# Altium schematic sheet panel-8-touch-pad.SchDoc
size B
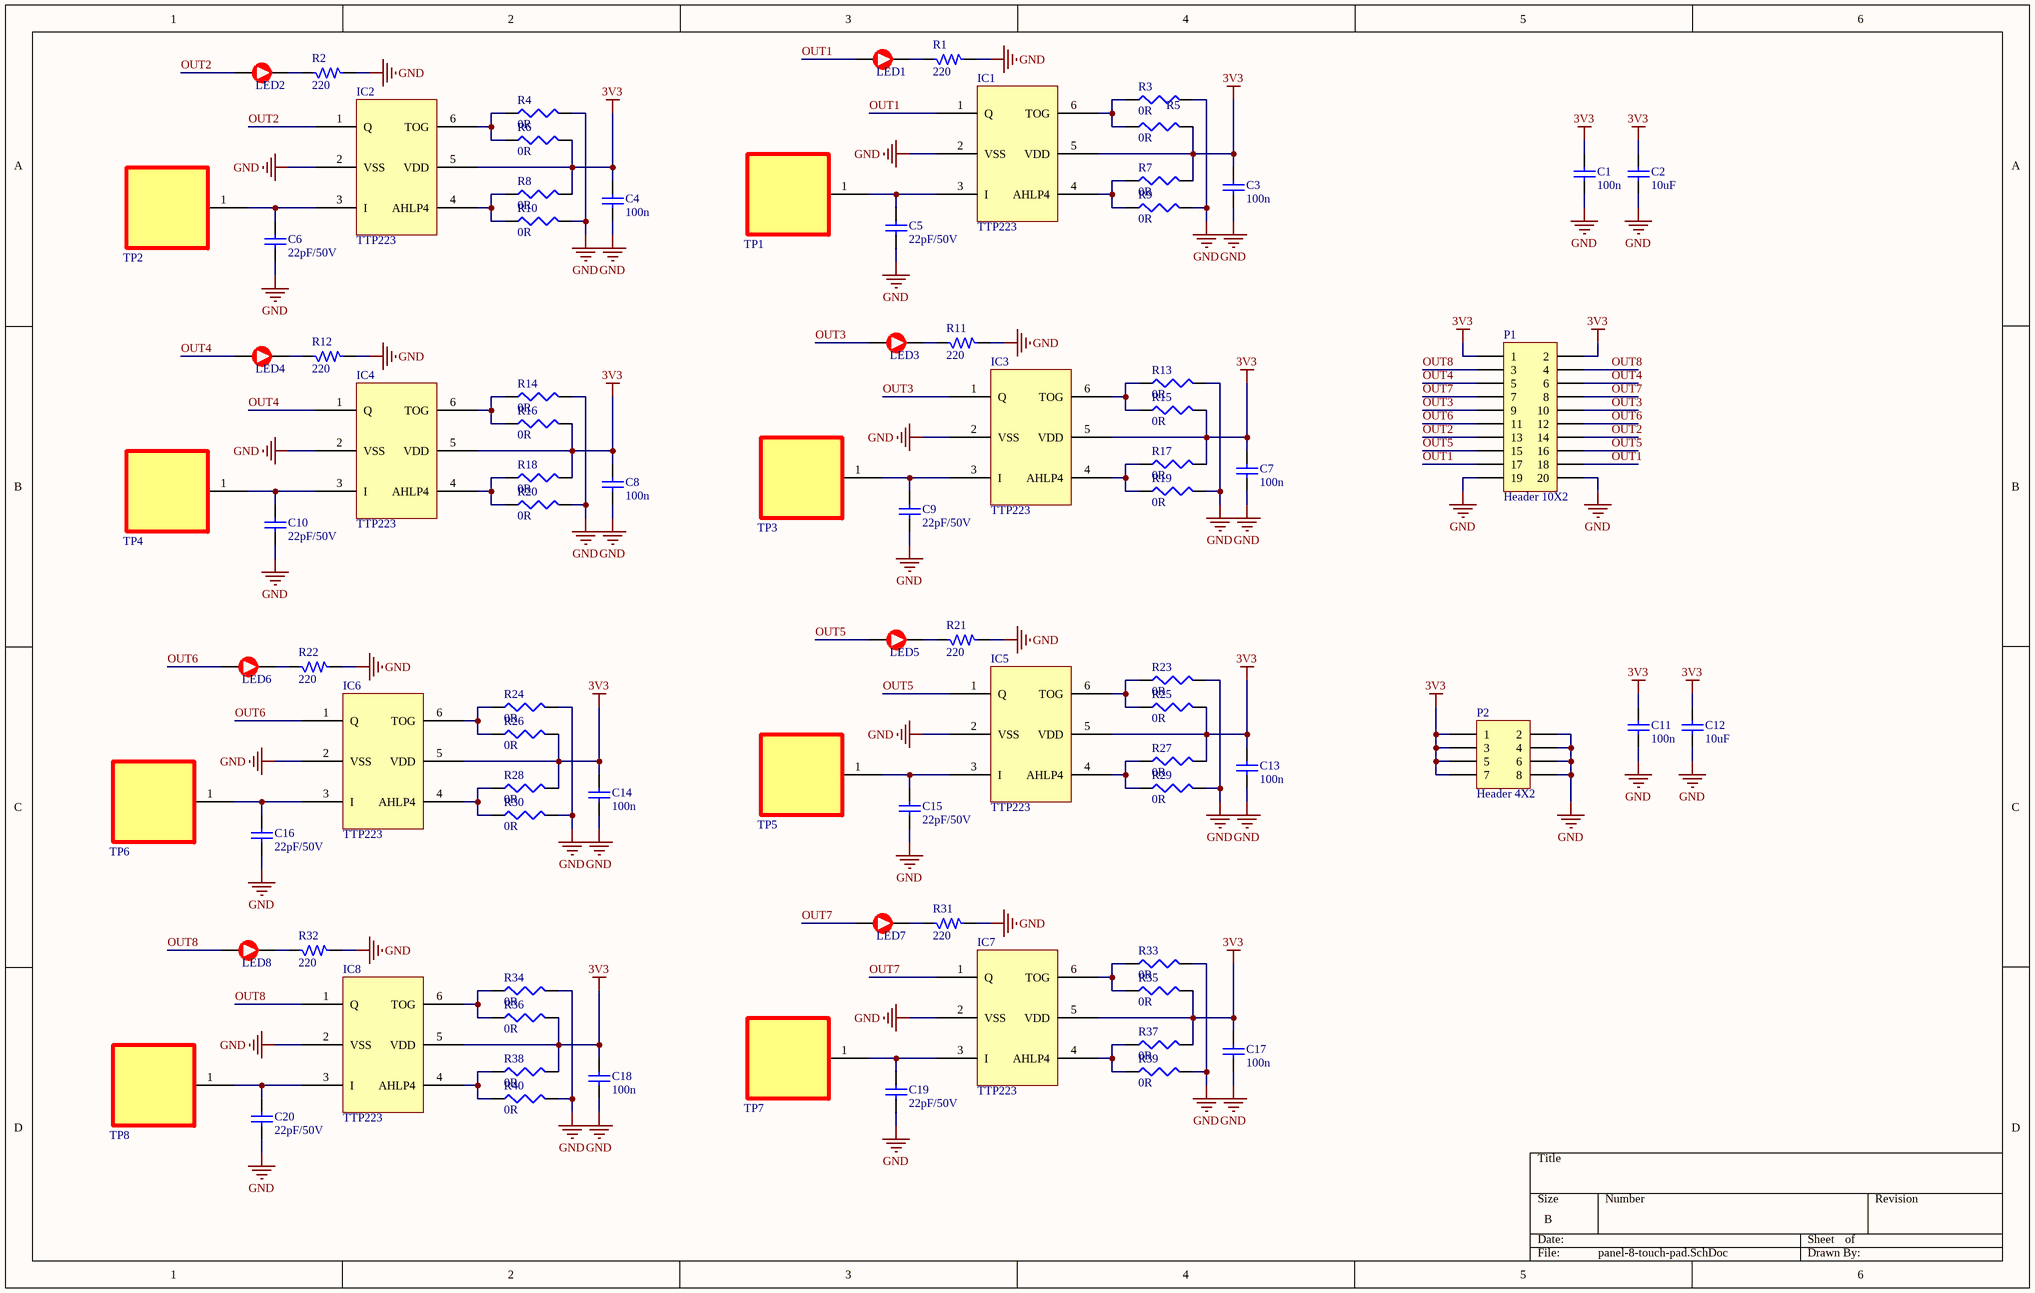
[diagram p0: panel-8-touch-pad.SchDoc]

## Parts
C1  100n  [C0805]
C2  10uF  [C1206]
C3  100n  [C0805]
C4  100n  [C0805]
C5  22pF/50V  [C0805]
C6  22pF/50V  [C0805]
C7  100n  [C0805]
C8  100n  [C0805]
C9  22pF/50V  [C0805]
C10  22pF/50V  [C0805]
C11  100n  [C0805]
C12  10uF  [C1206]
C13  100n  [C0805]
C14  100n  [C0805]
C15  22pF/50V  [C0805]
C16  22pF/50V  [C0805]
C17  100n  [C0805]
C18  100n  [C0805]
C19  22pF/50V  [C0805]
C20  22pF/50V  [C0805]
IC1  TTP223  [SOT23-6_L]
IC2  TTP223  [SOT23-6_L]
IC3  TTP223  [SOT23-6_L]
IC4  TTP223  [SOT23-6_L]
IC5  TTP223  [SOT23-6_L]
IC6  TTP223  [SOT23-6_L]
IC7  TTP223  [SOT23-6_L]
IC8  TTP223  [SOT23-6_L]
LED1  (no value)  [LED_0805_Blue]
LED2  (no value)  [LED_0805_Blue]
LED3  (no value)  [LED_0805_Blue]
LED4  (no value)  [LED_0805_Blue]
LED5  (no value)  [LED_0805_Blue]
LED6  (no value)  [LED_0805_Blue]
LED7  (no value)  [LED_0805_Blue]
LED8  (no value)  [LED_0805_Blue]
P1  Header 10X2  [HDR2X10 - SMD - 2mm]
P2  Header 4X2  [HDR2X4 - SMD - 2mm]
R1  220  [R0805]
R2  220  [R0805]
R3  0R  [R0805]
R4  0R  [R0805]
R5  0R  [R0805]
R6  0R  [R0805]
R7  0R  [R0805]
R8  0R  [R0805]
R9  0R  [R0805]
R10  0R  [R0805]
R11  220  [R0805]
R12  220  [R0805]
R13  0R  [R0805]
R14  0R  [R0805]
R15  0R  [R0805]
R16  0R  [R0805]
R17  0R  [R0805]
R18  0R  [R0805]
R19  0R  [R0805]
R20  0R  [R0805]
R21  220  [R0805]
R22  220  [R0805]
R23  0R  [R0805]
R24  0R  [R0805]
R25  0R  [R0805]
R26  0R  [R0805]
R27  0R  [R0805]
R28  0R  [R0805]
R29  0R  [R0805]
R30  0R  [R0805]
R31  220  [R0805]
R32  220  [R0805]
R33  0R  [R0805]
R34  0R  [R0805]
R35  0R  [R0805]
R36  0R  [R0805]
R37  0R  [R0805]
R38  0R  [R0805]
R39  0R  [R0805]
R40  0R  [R0805]
TP1  TP  [Touch-Pad-Rec]  (value not drawn)
TP2  TP  [Touch-Pad-Rec]  (value not drawn)
TP3  TP  [Touch-Pad-Rec]  (value not drawn)
TP4  TP  [Touch-Pad-Rec]  (value not drawn)
TP5  TP  [Touch-Pad-Rec]  (value not drawn)
TP6  TP  [Touch-Pad-Rec]  (value not drawn)
TP7  TP  [Touch-Pad-Rec]  (value not drawn)
TP8  TP  [Touch-Pad-Rec]  (value not drawn)

## Nets
3V3: C1.1 C2.1 C3.1 C4.1 C7.1 C8.1 C11.1 C12.1 C13.1 C14.1 C17.1 C18.1 IC1.5(VDD) IC2.5(VDD) IC3.5(VDD) IC4.5(VDD) IC5.5(VDD) IC6.5(VDD) IC7.5(VDD) IC8.5(VDD) P1.1 P1.2 P2.1 P2.3 P2.5 P2.7 R5.2 R6.2 R7.2 R8.2 R15.2 R16.2 R17.2 R18.2 R25.2 R26.2 R27.2 R28.2 R35.2 R36.2 R37.2 R38.2
GND: C1.2 C2.2 C3.2 C4.2 C5.2 C6.2 C7.2 C8.2 C9.2 C10.2 C11.2 C12.2 C13.2 C14.2 C15.2 C16.2 C17.2 C18.2 C19.2 C20.2 IC1.2(VSS) IC2.2(VSS) IC3.2(VSS) IC4.2(VSS) IC5.2(VSS) IC6.2(VSS) IC7.2(VSS) IC8.2(VSS) P1.19 P1.20 P2.2 P2.4 P2.6 P2.8 R1.2 R2.2 R3.2 R4.2 R9.2 R10.2 R11.2 R12.2 R13.2 R14.2 R19.2 R20.2 R21.2 R22.2 R23.2 R24.2 R29.2 R30.2 R31.2 R32.2 R33.2 R34.2 R39.2 R40.2
OUT1: IC1.1(Q) LED1.2 P1.17 P1.18
OUT2: IC2.1(Q) LED2.2 P1.13 P1.14
OUT3: IC3.1(Q) LED3.2 P1.9 P1.10
OUT4: IC4.1(Q) LED4.2 P1.5 P1.6
OUT5: IC5.1(Q) LED5.2 P1.15 P1.16
OUT6: IC6.1(Q) LED6.2 P1.11 P1.12
OUT7: IC7.1(Q) LED7.2 P1.7 P1.8
OUT8: IC8.1(Q) LED8.2 P1.3 P1.4
NetC5_1: C5.1 IC1.3(I) TP1.1
NetC6_1: C6.1 IC2.3(I) TP2.1
NetC9_1: C9.1 IC3.3(I) TP3.1
NetC10_1: C10.1 IC4.3(I) TP4.1
NetC15_1: C15.1 IC5.3(I) TP5.1
NetC16_1: C16.1 IC6.3(I) TP6.1
NetC19_1: C19.1 IC7.3(I) TP7.1
NetC20_1: C20.1 IC8.3(I) TP8.1
NetIC1_4: IC1.4(AHLP4) R7.1 R9.1
NetIC1_6: IC1.6(TOG) R3.1 R5.1
NetIC2_4: IC2.4(AHLP4) R8.1 R10.1
NetIC2_6: IC2.6(TOG) R4.1 R6.1
NetIC3_4: IC3.4(AHLP4) R17.1 R19.1
NetIC3_6: IC3.6(TOG) R13.1 R15.1
NetIC4_4: IC4.4(AHLP4) R18.1 R20.1
NetIC4_6: IC4.6(TOG) R14.1 R16.1
NetIC5_4: IC5.4(AHLP4) R27.1 R29.1
NetIC5_6: IC5.6(TOG) R23.1 R25.1
NetIC6_4: IC6.4(AHLP4) R28.1 R30.1
NetIC6_6: IC6.6(TOG) R24.1 R26.1
NetIC7_4: IC7.4(AHLP4) R37.1 R39.1
NetIC7_6: IC7.6(TOG) R33.1 R35.1
NetIC8_4: IC8.4(AHLP4) R38.1 R40.1
NetIC8_6: IC8.6(TOG) R34.1 R36.1
NetLED1_1: LED1.1 R1.1
NetLED2_1: LED2.1 R2.1
NetLED3_1: LED3.1 R11.1
NetLED4_1: LED4.1 R12.1
NetLED5_1: LED5.1 R21.1
NetLED6_1: LED6.1 R22.1
NetLED7_1: LED7.1 R31.1
NetLED8_1: LED8.1 R32.1

## Library data of the parts
C1-C20 = Cap Semi: Capacitor 100n 16V 0603; Published: 8-Jun-2000; LatestRevisionDate: 29-May-2009; LatestRevisionNote: IPC-7351 Footprint Added.; PackageReference: C1206; Publisher: Altium Limited; PackageDescription: Chip Capacitor
IC1-IC8 = TTP223: TTP223 Touch
LED1-LED8 = Led: Manufacturer No: HT204SURD; Manufacturer: Harvatek; Color: RED; Wavelength: 630nm; Brightness: 30-200 mcd; Size: 3mm; Specification: ="Color"+" " +"Wavelength"+" "+"Brightness"
P1 = Header 10X2: Header, 10-Pin, Dual row; LatestRevisionDate: 17-Jul-2002; LatestRevisionNote: Re-released for DXP Platform.; Publisher: Altium Limited
P2 = Header 4X2: Header, 4-Pin, Dual row; LatestRevisionDate: 17-Jul-2002; LatestRevisionNote: Re-released for DXP Platform.; Publisher: Altium Limited
R1 R2 R11 R12 R21 R22 R31 R32 = RM: Resistor SMD; Manufacturer No: RM10JTN102; Manufacturer: UniOhm; Power Rating: 1/10W; Value: 220; Specification: ="Value" + "  "+ "Power Rating"
R3-R10 R13-R20 R23-R30 R33-R40 = Res3: Resistor 10k 0603; Published: 8-Jun-2000; LatestRevisionDate: 29-May-2009; LatestRevisionNote: IPC-7351 Footprint Added.; PackageReference: J1-0603; Publisher: Altium Limited; PackageDescription: Chip Resistor
TP1-TP8 = Touch-Pad: Touch Pad